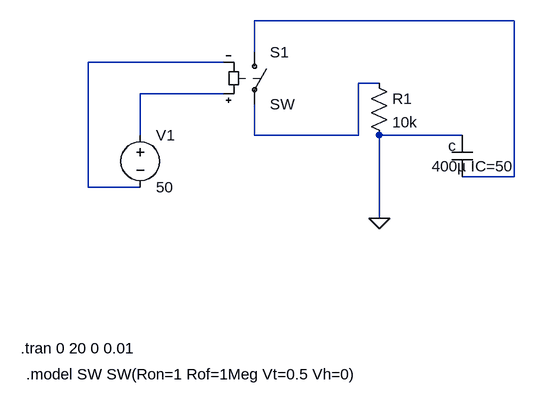
[diagram p0: schematic beforet=0.asc]
beforet=0.asc, the LTspice schematic file:
Version 4
SHEET 1 880 680
WIRE 768 64 368 64
WIRE 368 112 368 64
WIRE 320 128 112 128
WIRE 560 160 528 160
WIRE 320 176 192 176
WIRE 192 240 192 176
WIRE 368 240 368 192
WIRE 528 240 528 160
WIRE 528 240 368 240
WIRE 688 240 560 240
WIRE 768 304 768 64
WIRE 768 304 688 304
WIRE 112 320 112 128
WIRE 192 320 112 320
WIRE 560 368 560 240
FLAG 560 368 0
SYMBOL Cap 672 240 R0
WINDOW 0 0 32 Bottom 2
WINDOW 3 32 32 Top 2
SYMATTR InstName c
SYMATTR Value 400µ IC=50
SYMBOL sw 368 96 R0
SYMATTR InstName S1
SYMBOL Voltage 192 224 R0
SYMATTR InstName V1
SYMATTR Value 50
SYMBOL Res 544 144 R0
SYMATTR InstName R1
SYMATTR Value 10k
TEXT 8 568 Left 2 !.tran 0 20 0 0.01
TEXT 16 608 Left 2 !.model SW SW(Ron=1 Rof=1Meg Vt=0.5 Vh=0)

The netlist it stands for:
* beforet=0.asc
c 0 N001 400µ IC=50
S1 N001 N003 N004 N002 SW
V1 N004 N002 50
R1 N003 0 10k
.tran 0 20 0 0.01
.model SW SW(Ron=1 Rof=1Meg Vt=0.5 Vh=0)
.backanno
.end